# Altium schematic sheet spt8MapMCUx2.SCHDOC: LiveDesign Evaluation - Video Games
size C; Organization: Altium Limited; Address1: L3, 12a Rodborough Rd; Address2: Frenchs Forest; Address3: NSW; Address4: Australia 2086; DocumentNumber: 1; SheetNumber: 1; SheetTotal: 11
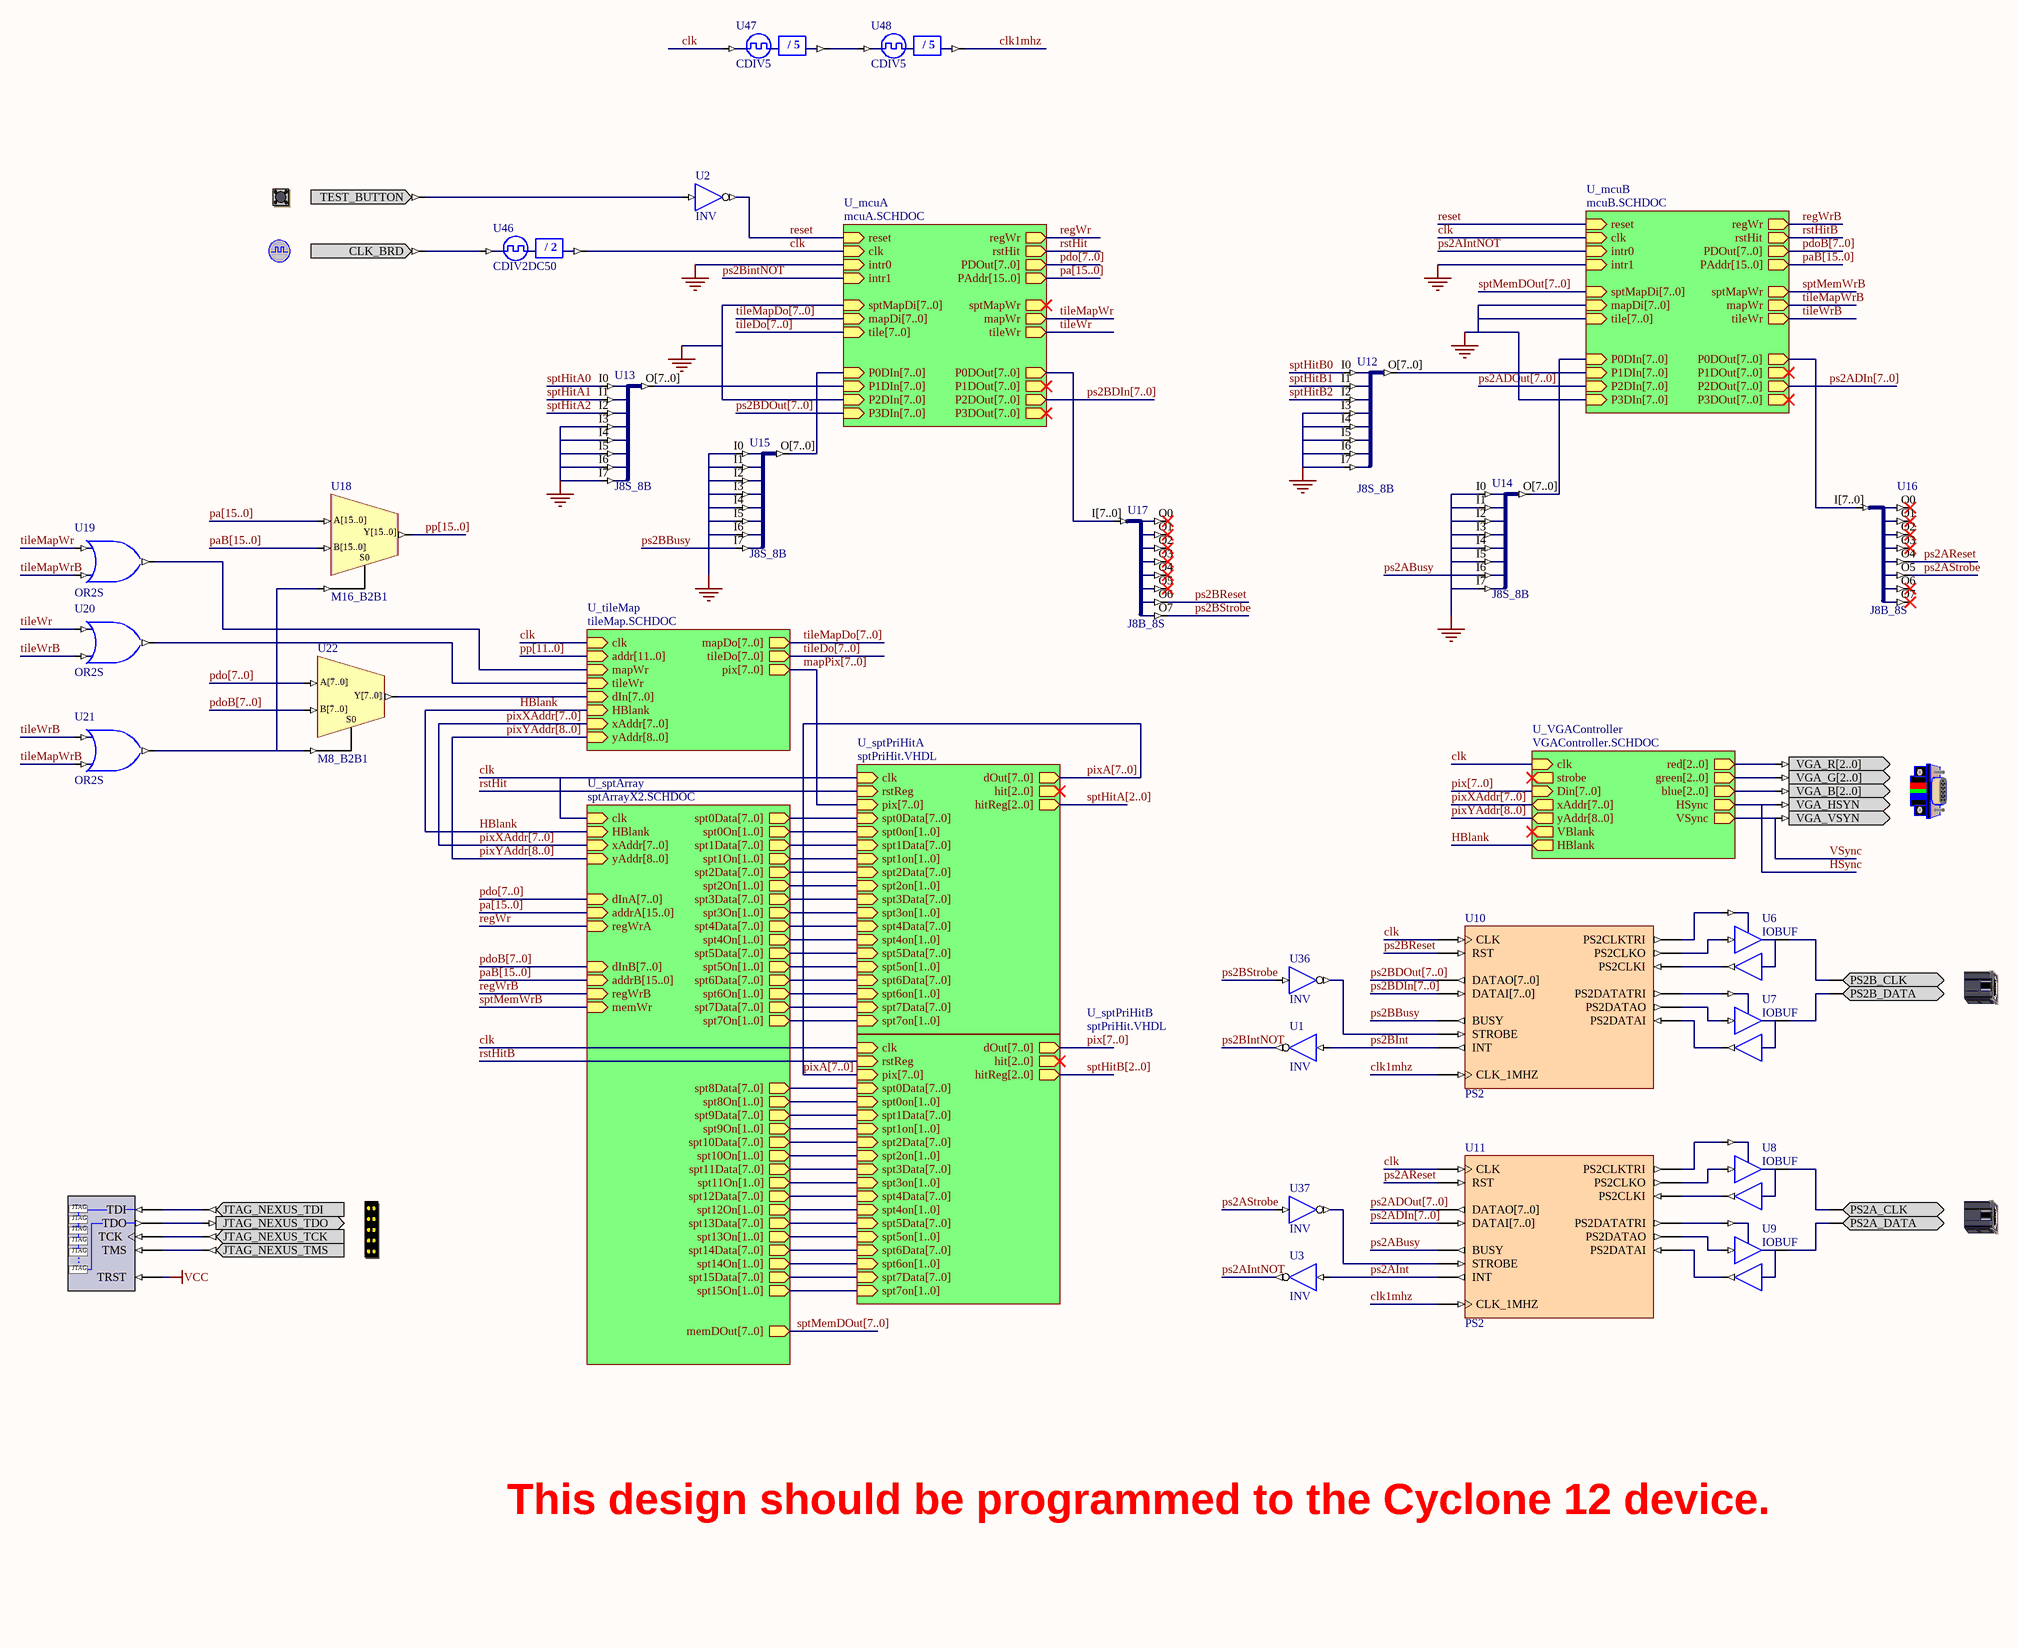
[diagram p0: spt8MapMCUx2.SCHDOC]

## Parts
CLOCK_BOARD  CLOCK_BOARD  (value not drawn)
NEXUS_JTAG_CONNECTOR  NEXUS_JTAG_CONNECTOR  (value not drawn)
NEXUS_JTAG_PORT  NEXUS_JTAG_PORT  (value not drawn)
PS2A  PS2A  (value not drawn)
PS2B  PS2B  (value not drawn)
TEST_BUTTON  TEST_BUTTON  (value not drawn)
U1  INV
U2  INV
U3  INV
U6  IOBUF
U7  IOBUF
U8  IOBUF
U9  IOBUF
U10  PS2
U11  PS2
U12  J8S_8B
U13  J8S_8B
U14  J8S_8B
U15  J8S_8B
U16  J8B_8S
U17  J8B_8S
U18  M16_B2B1
U19  OR2S
U20  OR2S
U21  OR2S
U22  M8_B2B1
U36  INV
U37  INV
U46  CDIV2DC50
U47  CDIV5
U48  CDIV5
VGACNTR  VGACNTR  (value not drawn)

## Sub-sheets
U_mcuA = mcuA.SCHDOC: reset (in), clk (in), intr0 (in), intr1 (in), sptMapDi[7..0] (in), mapDi[7..0] (in), tile[7..0] (in), regWr (out), sptMapWr (out), mapWr (out), tileWr (out), rstHit (out), P0DOut[7..0] (out), P0DIn[7..0] (in), P1DOut[7..0] (out), P1DIn[7..0] (in), P2DOut[7..0] (out), P2DIn[7..0] (in), P3DOut[7..0] (out), P3DIn[7..0] (in), PAddr[15..0] (out), PDOut[7..0] (out)
U_mcuB = mcuB.SCHDOC: reset (in), clk (in), intr0 (in), intr1 (in), sptMapDi[7..0] (in), mapDi[7..0] (in), tile[7..0] (in), regWr (out), sptMapWr (out), mapWr (out), tileWr (out), rstHit (out), P0DOut[7..0] (out), P0DIn[7..0] (in), P1DOut[7..0] (out), P1DIn[7..0] (in), P2DOut[7..0] (out), P2DIn[7..0] (in), P3DOut[7..0] (out), P3DIn[7..0] (in), PAddr[15..0] (out), PDOut[7..0] (out)
U_sptArray = sptArrayX2.SCHDOC: HBlank (in), yAddr[8..0] (in), xAddr[7..0] (in), spt0Data[7..0] (out), spt0On[1..0] (out), spt1Data[7..0] (out), spt1On[1..0] (out), spt2Data[7..0] (out), spt2On[1..0] (out), spt3Data[7..0] (out), spt3On[1..0] (out), spt4Data[7..0] (out), spt4On[1..0] (out), spt5Data[7..0] (out), spt5On[1..0] (out), spt6Data[7..0] (out), spt6On[1..0] (out), spt7Data[7..0] (out), spt7On[1..0] (out), clk (in), memWr (in), memDOut[7..0] (out), spt10On[1..0] (out), spt11Data[7..0] (out), spt11On[1..0] (out), spt12Data[7..0] (out), spt12On[1..0] (out), spt13Data[7..0] (out), spt13On[1..0] (out), spt8Data[7..0] (out), spt8On[1..0] (out), spt9Data[7..0] (out), spt9On[1..0] (out), spt10Data[7..0] (out), spt14Data[7..0] (out), spt14On[1..0] (out), spt15Data[7..0] (out), spt15On[1..0] (out), dInA[7..0] (in), regWrA (in), addrA[15..0] (in), regWrB (in), dInB[7..0] (in), addrB[15..0] (in)
U_sptPriHitA = sptPriHit.VHDL: clk (in), dOut[7..0] (out), hit[2..0] (out), hitReg[2..0] (out), pix[7..0] (in), rstReg (in), spt0Data[7..0] (in), spt0on[1..0] (in), spt1Data[7..0] (in), spt1on[1..0] (in), spt2Data[7..0] (in), spt2on[1..0] (in), spt3Data[7..0] (in), spt3on[1..0] (in), spt4Data[7..0] (in), spt4on[1..0] (in), spt5Data[7..0] (in), spt5on[1..0] (in), spt6Data[7..0] (in), spt6on[1..0] (in), spt7Data[7..0] (in), spt7on[1..0] (in)  | VHDLENTITY: sptPriHit
U_sptPriHitB = sptPriHit.VHDL: clk (in), dOut[7..0] (out), hit[2..0] (out), hitReg[2..0] (out), pix[7..0] (in), rstReg (in), spt0Data[7..0] (in), spt0on[1..0] (in), spt1Data[7..0] (in), spt1on[1..0] (in), spt2Data[7..0] (in), spt2on[1..0] (in), spt3Data[7..0] (in), spt3on[1..0] (in), spt4Data[7..0] (in), spt4on[1..0] (in), spt5Data[7..0] (in), spt5on[1..0] (in), spt6Data[7..0] (in), spt6on[1..0] (in), spt7Data[7..0] (in), spt7on[1..0] (in)  | VHDLENTITY: sptPriHit
U_tileMap = tileMap.SCHDOC: clk (in), addr[11..0] (in), mapWr (in), tileWr (in), dIn[7..0] (in), HBlank (in), pix[7..0] (out), xAddr[7..0] (in), yAddr[8..0] (in), tileDo[7..0] (out), mapDo[7..0] (out)
U_VGAController = VGAController.SCHDOC: green[2..0] (out), red[2..0] (out), blue[2..0] (out), HSync (out), VSync (out), clk (in), strobe (out), Din[7..0] (in), xAddr[7..0] (out), yAddr[8..0] (out), VBlank (out), HBlank (out)

## Nets
GND: U12.I3 U12.I4 U12.I5 U12.I6 U12.I7 U13.I3 U13.I4 U13.I5 U13.I6 U13.I7 U14.I0 U14.I1 U14.I2 U14.I3 U14.I4 U14.I5 U14.I7 U15.I0 U15.I1 U15.I2 U15.I3 U15.I4 U15.I5 U15.I6 ; sheet U_mcuA/intr0, sheet U_mcuB/intr1
VCC: NEXUS_JTAG_PORT.TRST
clk: U10.CLK U11.CLK U46.CLKDV U47.CLKIN ; sheet U_sptArray/clk, sheet U_sptPriHitA/clk, sheet U_VGAController/clk, sheet U_tileMap/clk, sheet U_mcuA/clk, sheet U_mcuB/clk, sheet U_sptPriHitB/clk
clk1mhz: U10.CLK_1MHZ U11.CLK_1MHZ U48.CLKDV
HBlank: sheet U_sptArray/HBlank, sheet U_VGAController/HBlank, sheet U_tileMap/HBlank
HSync: VGACNTR.VGA_HSYN ; sheet U_VGAController/HSync
pa[15..0]: U18.A[15..0] ; sheet U_sptArray/addrA[15..0], sheet U_mcuA/PAddr[15..0]
paB[15..0]: U18.B[15..0] ; sheet U_sptArray/addrB[15..0], sheet U_mcuB/PAddr[15..0]
pdo[7..0]: U22.A[7..0] ; sheet U_sptArray/dInA[7..0], sheet U_mcuA/PDOut[7..0]
pdoB[7..0]: U22.B[7..0] ; sheet U_sptArray/dInB[7..0], sheet U_mcuB/PDOut[7..0]
pp[15..0]: U18.Y[15..0]
ps2ABusy: U11.BUSY U14.I6
ps2ADIn[7..0]: U11.DATAI[7..0] ; sheet U_mcuB/P2DOut[7..0]
ps2ADOut[7..0]: U11.DATAO[7..0] ; sheet U_mcuB/P2DIn[7..0]
ps2AInt: U3.I U11.INT
ps2AIntNOT: U3.O ; sheet U_mcuB/intr0
ps2AReset: U11.RST U16.O4
ps2AStrobe: U16.O5 U37.I
ps2BBusy: U10.BUSY U15.I7
ps2BDIn[7..0]: U10.DATAI[7..0] ; sheet U_mcuA/P2DOut[7..0]
ps2BDOut[7..0]: U10.DATAO[7..0] ; sheet U_mcuA/P3DIn[7..0]
ps2BInt: U1.I U10.INT
ps2BintNOT: U1.O ; sheet U_mcuA/intr1
ps2BReset: U10.RST U17.O6
ps2BStrobe: U17.O7 U36.I
regWr: sheet U_sptArray/regWrA, sheet U_mcuA/regWr
regWrB: sheet U_sptArray/regWrB, sheet U_mcuB/regWr
reset: U2.O ; sheet U_mcuA/reset, sheet U_mcuB/reset
rstHit: sheet U_sptPriHitA/rstReg, sheet U_mcuA/rstHit
rstHitB: sheet U_mcuB/rstHit, sheet U_sptPriHitB/rstReg
sptHitA0: U13.I0
sptHitA1: U13.I1
sptHitA2: U13.I2
sptHitB0: U12.I0
sptHitB1: U12.I1
sptHitB2: U12.I2
sptMemWrB: sheet U_sptArray/memWr, sheet U_mcuB/sptMapWr
tileMapWr: U19.I0 ; sheet U_mcuA/mapWr
tileMapWrB: U19.I1 U21.I1 ; sheet U_mcuB/mapWr
tileWr: U20.I0 ; sheet U_mcuA/tileWr
tileWrB: U20.I1 U21.I0 ; sheet U_mcuB/tileWr
VSync: VGACNTR.VGA_VSYN ; sheet U_VGAController/VSync
NetCLOCK_BOARD_CLK_BRD: CLOCK_BOARD.CLK_BRD U46.CLKIN
NetNEXUS_JTAG_CONNECTOR_JTAG_NEXUS_TCK: NEXUS_JTAG_CONNECTOR.JTAG_NEXUS_TCK NEXUS_JTAG_PORT.TCK
NetNEXUS_JTAG_CONNECTOR_JTAG_NEXUS_TDI: NEXUS_JTAG_CONNECTOR.JTAG_NEXUS_TDI NEXUS_JTAG_PORT.TDI
NetNEXUS_JTAG_CONNECTOR_JTAG_NEXUS_TDO: NEXUS_JTAG_CONNECTOR.JTAG_NEXUS_TDO NEXUS_JTAG_PORT.TDO
NetNEXUS_JTAG_CONNECTOR_JTAG_NEXUS_TMS: NEXUS_JTAG_CONNECTOR.JTAG_NEXUS_TMS NEXUS_JTAG_PORT.TMS
NetPS2A_PS2A_CLK: PS2A.PS2A_CLK U8.IO
NetPS2A_PS2A_DATA: PS2A.PS2A_DATA U9.IO
NetPS2B_PS2B_CLK: PS2B.PS2B_CLK U6.IO
NetPS2B_PS2B_DATA: PS2B.PS2B_DATA U7.IO
NetTEST_BUTTON_TEST_BUTTON: TEST_BUTTON.TEST_BUTTON U2.I
NetU6_I: U6.I U10.PS2CLKO
NetU6_O: U6.O U10.PS2CLKI
NetU6_T: U6.T U10.PS2CLKTRI
NetU7_I: U7.I U10.PS2DATAO
NetU7_O: U7.O U10.PS2DATAI
NetU7_T: U7.T U10.PS2DATATRI
NetU8_I: U8.I U11.PS2CLKO
NetU8_O: U8.O U11.PS2CLKI
NetU8_T: U8.T U11.PS2CLKTRI
NetU9_I: U9.I U11.PS2DATAO
NetU9_O: U9.O U11.PS2DATAI
NetU9_T: U9.T U11.PS2DATATRI
NetU10_STROBE: U10.STROBE U36.O
NetU11_STROBE: U11.STROBE U37.O
NetU12_O[7..0]: U12.O[7..0] ; sheet U_mcuB/P1DIn[7..0]
NetU13_O[7..0]: U13.O[7..0] ; sheet U_mcuA/P1DIn[7..0]
NetU14_O[7..0]: U14.O[7..0] ; sheet U_mcuB/P0DIn[7..0]
NetU15_O[7..0]: U15.O[7..0] ; sheet U_mcuA/P0DIn[7..0]
NetU16_I[7..0]: U16.I[7..0] ; sheet U_mcuB/P0DOut[7..0]
NetU17_I[7..0]: U17.I[7..0] ; sheet U_mcuA/P0DOut[7..0]
NetU18_S0: U18.S0 U21.O U22.S0
NetU19_O: U19.O ; sheet U_tileMap/mapWr
NetU20_O: U20.O ; sheet U_tileMap/tileWr
NetU22_Y[7..0]: U22.Y[7..0] ; sheet U_tileMap/dIn[7..0]
NetU47_CLKDV: U47.CLKDV U48.CLKIN
NetVGACNTR_VGA_B[2..0]: VGACNTR.VGA_B[2..0] ; sheet U_VGAController/blue[2..0]
NetVGACNTR_VGA_G[2..0]: VGACNTR.VGA_G[2..0] ; sheet U_VGAController/green[2..0]
NetVGACNTR_VGA_R[2..0]: VGACNTR.VGA_R[2..0] ; sheet U_VGAController/red[2..0]

Not connected (* = marked no-connect by the designer): U16 O0* O1* O2* O3* O6* O7*; U17 O0* O1* O2* O3* O4* O5*

## Buses and harness runs
bus mapPix[7..0] = sheet U_sptPriHitA/pix[7..0] = sheet U_tileMap/pix[7..0]
bus pa[15..0]
bus pa[15..0] = sheet U_mcuA/PAddr[15..0]
bus pa[15..0] = sheet U_sptArray/addrA[15..0]
bus paB[15..0]
bus paB[15..0] = sheet U_mcuB/PAddr[15..0]
bus paB[15..0] = sheet U_sptArray/addrB[15..0]
bus pdo[7..0]
bus pdo[7..0] = sheet U_mcuA/PDOut[7..0]
bus pdo[7..0] = sheet U_sptArray/dInA[7..0]
bus pdoB[7..0]
bus pdoB[7..0] = sheet U_mcuB/PDOut[7..0]
bus pdoB[7..0] = sheet U_sptArray/dInB[7..0]
bus pix[7..0] = sheet U_sptPriHitB/dOut[7..0]
bus pix[7..0] = sheet U_VGAController/Din[7..0]
bus pixA[7..0] = sheet U_sptPriHitA/dOut[7..0] = sheet U_sptPriHitB/pix[7..0]
bus pixXAddr[7..0] = sheet U_sptArray/xAddr[7..0] = sheet U_tileMap/xAddr[7..0]
bus pixXAddr[7..0] = sheet U_VGAController/xAddr[7..0]
bus pixYAddr[8..0] = sheet U_sptArray/yAddr[8..0] = sheet U_tileMap/yAddr[8..0]
bus pixYAddr[8..0] = sheet U_VGAController/yAddr[8..0]
bus pp[11..0] = sheet U_tileMap/addr[11..0]
bus pp[15..0]
bus ps2ADIn[7..0]
bus ps2ADIn[7..0] = sheet U_mcuB/P2DOut[7..0]
bus ps2ADOut[7..0]
bus ps2ADOut[7..0] = sheet U_mcuB/P2DIn[7..0]
bus ps2BDIn[7..0]
bus ps2BDIn[7..0] = sheet U_mcuA/P2DOut[7..0]
bus ps2BDOut[7..0]
bus ps2BDOut[7..0] = sheet U_mcuA/P3DIn[7..0]
bus sheet U_mcuA/P2DIn[7..0] = sheet U_mcuA/sptMapDi[7..0]
bus sheet U_mcuB/mapDi[7..0] = sheet U_mcuB/P3DIn[7..0] = sheet U_mcuB/tile[7..0]
bus sheet U_sptArray/spt0Data[7..0] = sheet U_sptPriHitA/spt0Data[7..0]
bus sheet U_sptArray/spt0On[1..0] = sheet U_sptPriHitA/spt0on[1..0]
bus sheet U_sptArray/spt1Data[7..0] = sheet U_sptPriHitA/spt1Data[7..0]
bus sheet U_sptArray/spt1On[1..0] = sheet U_sptPriHitA/spt1on[1..0]
bus sheet U_sptArray/spt2Data[7..0] = sheet U_sptPriHitA/spt2Data[7..0]
bus sheet U_sptArray/spt2On[1..0] = sheet U_sptPriHitA/spt2on[1..0]
bus sheet U_sptArray/spt3Data[7..0] = sheet U_sptPriHitA/spt3Data[7..0]
bus sheet U_sptArray/spt3On[1..0] = sheet U_sptPriHitA/spt3on[1..0]
bus sheet U_sptArray/spt4Data[7..0] = sheet U_sptPriHitA/spt4Data[7..0]
bus sheet U_sptArray/spt4On[1..0] = sheet U_sptPriHitA/spt4on[1..0]
bus sheet U_sptArray/spt5Data[7..0] = sheet U_sptPriHitA/spt5Data[7..0]
bus sheet U_sptArray/spt5On[1..0] = sheet U_sptPriHitA/spt5on[1..0]
bus sheet U_sptArray/spt6Data[7..0] = sheet U_sptPriHitA/spt6Data[7..0]
bus sheet U_sptArray/spt6On[1..0] = sheet U_sptPriHitA/spt6on[1..0]
bus sheet U_sptArray/spt7Data[7..0] = sheet U_sptPriHitA/spt7Data[7..0]
bus sheet U_sptArray/spt7On[1..0] = sheet U_sptPriHitA/spt7on[1..0]
bus sheet U_sptArray/spt8Data[7..0] = sheet U_sptPriHitB/spt0Data[7..0]
bus sheet U_sptArray/spt8On[1..0] = sheet U_sptPriHitB/spt0on[1..0]
bus sheet U_sptArray/spt9Data[7..0] = sheet U_sptPriHitB/spt1Data[7..0]
bus sheet U_sptArray/spt9On[1..0] = sheet U_sptPriHitB/spt1on[1..0]
bus sheet U_sptArray/spt10Data[7..0] = sheet U_sptPriHitB/spt2Data[7..0]
bus sheet U_sptArray/spt10On[1..0] = sheet U_sptPriHitB/spt2on[1..0]
bus sheet U_sptArray/spt11Data[7..0] = sheet U_sptPriHitB/spt3Data[7..0]
bus sheet U_sptArray/spt11On[1..0] = sheet U_sptPriHitB/spt3on[1..0]
bus sheet U_sptArray/spt12Data[7..0] = sheet U_sptPriHitB/spt4Data[7..0]
bus sheet U_sptArray/spt12On[1..0] = sheet U_sptPriHitB/spt4on[1..0]
bus sheet U_sptArray/spt13Data[7..0] = sheet U_sptPriHitB/spt5Data[7..0]
bus sheet U_sptArray/spt13On[1..0] = sheet U_sptPriHitB/spt5on[1..0]
bus sheet U_sptArray/spt14Data[7..0] = sheet U_sptPriHitB/spt6Data[7..0]
bus sheet U_sptArray/spt14On[1..0] = sheet U_sptPriHitB/spt6on[1..0]
bus sheet U_sptArray/spt15Data[7..0] = sheet U_sptPriHitB/spt7Data[7..0]
bus sheet U_sptArray/spt15On[1..0] = sheet U_sptPriHitB/spt7on[1..0]
bus sptHitA[2..0] = sheet U_sptPriHitA/hitReg[2..0]
bus sptHitB[2..0] = sheet U_sptPriHitB/hitReg[2..0]
bus sptMemDOut[7..0] = sheet U_mcuB/sptMapDi[7..0]
bus sptMemDOut[7..0] = sheet U_sptArray/memDOut[7..0]
bus tileDo[7..0] = sheet U_mcuA/tile[7..0]
bus tileDo[7..0] = sheet U_tileMap/tileDo[7..0]
bus tileMapDo[7..0] = sheet U_mcuA/mapDi[7..0]
bus tileMapDo[7..0] = sheet U_tileMap/mapDo[7..0]

## Notes on the sheet
- This design should be programmed to the Cyclone 12 device.
- Title
- Size:
- Date:
- File:
- C
- Number:
- Time:
- Revision:
- Sheet
- of
- (in symbol CDIV2DC50) / 2
- (in symbol CDIV5) / 5
- (in symbol NEXUS_JTAG_PORT) JTAG; .

## Library data of the parts
CLOCK_BOARD = CLOCK_BOARD: Global System Clock Supply; PortComponent: True; Published: 19-Nov-2003; Publisher: Altium Limited
NEXUS_JTAG_CONNECTOR = NEXUS_JTAG_CONNECTOR: JTAG Port; PortComponent: True; Published: 19-Nov-2003; Publisher: Altium Limited
NEXUS_JTAG_PORT = NEXUS_JTAG_PORT: Soft Nexus-Chain Connector; NEXUS_JTAG_CONNECTOR: True; Published: 18-Dec-2003; Publisher: Altium Limited
PS2A = PS2A: Mouse PS2 Connector; PortComponent: True; Published: 19-Nov-2003; Publisher: Altium Limited
PS2B = PS2B: Key Board PS2 Connector; PortComponent: True; Published: 19-Nov-2003; Publisher: Altium Limited
TEST_BUTTON = TEST_BUTTON: Test Button; PortComponent: True; Published: 19-Nov-2003; Publisher: Altium Limited
U1 U3 = INV: Inverter; ArchiveName: GENERIC; Published: 7-Nov-2003; Publisher: Altium Limited; Xilinx Equivalent: INV; Core Revision: 1.00.00
U2 = INV: Inverter; Class I: Logic Primitive; ArchiveName: GENERIC; Published: 18-Sep-2003; Publisher: Altium Limited; Xilinx Equivalent: INV
U6-U9 = IOBUF: Input/Output Buffer; ArchiveName: GENERIC; Published: 18-Sep-2003; Publisher: Altium Limited; Class I: Buffer; Xilinx Equivalent: IOBUF
U10 U11 = PS2: PS2 Controller; Published: 3/02/2004; Publisher: Altium Hobart Technology Centre; Core Revision: 1.00.00
U12-U15 = J8S_8B: 8 Single pin inputs to single 8-Bit output bus; ArchiveName: GENERIC; Published: 7-Nov-2003; Publisher: Altium Limited; Core Revision: 1.00.00
U16 U17 = J8B_8S: 8-Bit input bus to 8 single pin outputs; ArchiveName: GENERIC; Published: 18-Dec-2003; Publisher: Altium Limited; Core Revision: 1.00.00
U18 = M16_B2B1: 2x16-Bit Bus to 1x16-Bit Bus Multiplexer; ArchiveName: GENERIC; Published: 7-Nov-2003; Publisher: Altium Limited; Core Revision: 1.00.00
U19-U21 = OR2S: 2-Input OR Gate, Single Pin Version; Xilinx Equivalent: OR2; ArchiveName: GENERIC; Published: 7-Nov-2003; Publisher: Altium Limited; Core Revision: 1.00.00
U22 = M8_B2B1: 2x8-Bit Bus to 1x8-Bit Bus Multiplexer; ArchiveName: GENERIC; Published: 7-Nov-2003; Publisher: Altium Limited; Core Revision: 1.00.00
U36 U37 = INV: Inverter; ArchiveName: GENERIC; VHDLIB_SIM: GENERIC_LIB; Published: 29-Jan-2004; Publisher: Altium Limited; Xilinx Equivalent: INV; Core Revision: 1.00.00
U46 = CDIV2DC50: Clock Divider by 2 with 50% Duty Cycle Output; Xilinx Equivalent: CLK_DIV2; ArchiveName: GENERIC; VHDLIB_SIM: GENERIC_LIB; Published: 29-Jan-2004; Publisher: Altium Limited; Core Revision: 1.00.00
U47 U48 = CDIV5: Clock Divider by 5; ArchiveName: GENERIC; VHDLIB_SIM: GENERIC_LIB; Published: 29-Jan-2004; Publisher: Altium Limited; Core Revision: 1.00.00
VGACNTR = VGACNTR: VGA Dsub-15-Female-HD; PortComponent: True; Published: 19-Nov-2003; Publisher: Altium Limited